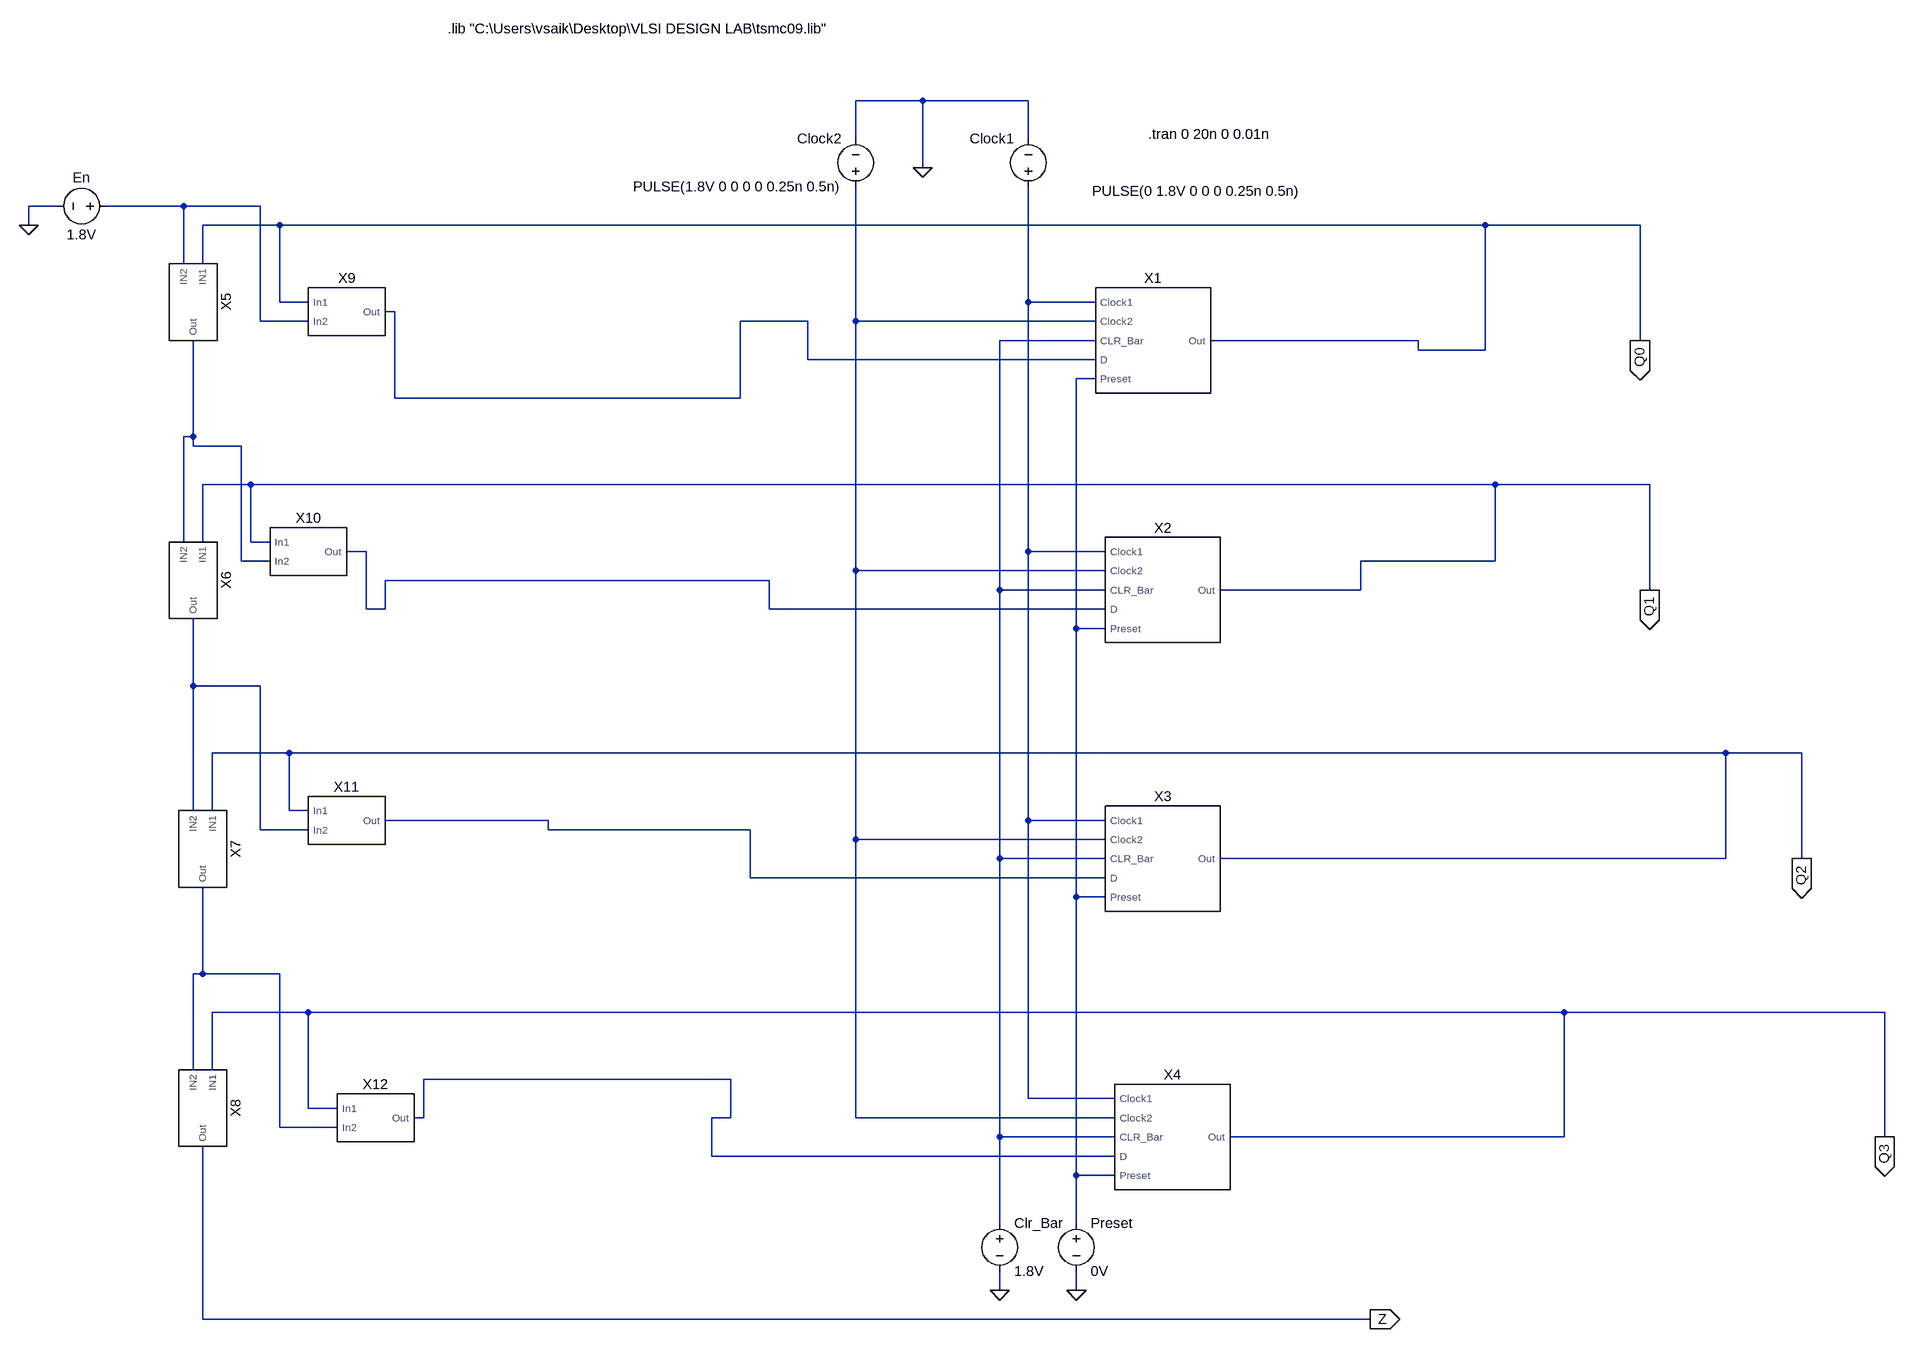
[diagram p0: schematic Counter1_P_Clr2_finally_final.asc]
Counter1_P_Clr2_finally_final.asc, the LTspice schematic file:
Version 4
SHEET 1 3432 2288
WIRE 912 160 800 160
WIRE 1088 160 912 160
WIRE 800 224 800 160
WIRE 1088 224 1088 160
WIRE 912 272 912 160
WIRE -560 336 -608 336
WIRE -320 336 -480 336
WIRE -192 336 -320 336
WIRE -608 368 -608 336
WIRE -160 368 -288 368
WIRE 2128 368 -160 368
WIRE 2464 368 2128 368
WIRE -320 432 -320 336
WIRE -288 432 -288 368
WIRE -160 496 -160 368
WIRE -112 496 -160 496
WIRE 1088 496 1088 304
WIRE 1200 496 1088 496
WIRE 32 512 16 512
WIRE -192 528 -192 336
WIRE -112 528 -192 528
WIRE 720 528 608 528
WIRE 800 528 800 304
WIRE 1200 528 800 528
WIRE 1200 560 1040 560
WIRE 1888 560 1392 560
WIRE 2464 560 2464 368
WIRE 1888 576 1888 560
WIRE 2128 576 2128 368
WIRE 2128 576 1888 576
WIRE 720 592 720 528
WIRE 1200 592 720 592
WIRE 1200 624 1168 624
WIRE 32 656 32 512
WIRE 608 656 608 528
WIRE 608 656 32 656
WIRE -304 720 -304 560
WIRE -304 720 -320 720
WIRE -304 736 -304 720
WIRE -224 736 -304 736
WIRE -208 800 -288 800
WIRE 2144 800 -208 800
WIRE 2480 800 2144 800
WIRE -320 896 -320 720
WIRE -288 896 -288 800
WIRE -208 896 -208 800
WIRE -176 896 -208 896
WIRE -16 912 -48 912
WIRE 1088 912 1088 496
WIRE 1216 912 1088 912
WIRE -224 928 -224 736
WIRE -176 928 -224 928
WIRE 2144 928 2144 800
WIRE 2144 928 1792 928
WIRE 800 944 800 528
WIRE 1216 944 800 944
WIRE 656 960 16 960
WIRE 1040 976 1040 560
WIRE 1216 976 1040 976
WIRE 1792 976 1792 928
WIRE 1792 976 1408 976
WIRE 2480 976 2480 800
WIRE -16 1008 -16 912
WIRE 16 1008 16 960
WIRE 16 1008 -16 1008
WIRE 656 1008 656 960
WIRE 1216 1008 656 1008
WIRE 1168 1040 1168 624
WIRE 1216 1040 1168 1040
WIRE -304 1136 -304 1024
WIRE -192 1136 -304 1136
WIRE -144 1248 -272 1248
WIRE 2720 1248 -144 1248
WIRE 2992 1248 2720 1248
WIRE -304 1344 -304 1136
WIRE -272 1344 -272 1248
WIRE -144 1344 -144 1248
WIRE -112 1344 -144 1344
WIRE 288 1360 16 1360
WIRE 1088 1360 1088 912
WIRE 1216 1360 1088 1360
WIRE -192 1376 -192 1136
WIRE -112 1376 -192 1376
WIRE 288 1376 288 1360
WIRE 624 1376 288 1376
WIRE 800 1392 800 944
WIRE 1216 1392 800 1392
WIRE 1040 1424 1040 976
WIRE 1216 1424 1040 1424
WIRE 2720 1424 2720 1248
WIRE 2720 1424 1408 1424
WIRE 2992 1424 2992 1248
WIRE 624 1456 624 1376
WIRE 1216 1456 624 1456
WIRE 1168 1488 1168 1040
WIRE 1216 1488 1168 1488
WIRE -288 1616 -288 1472
WIRE -288 1616 -304 1616
WIRE -160 1616 -288 1616
WIRE -112 1680 -272 1680
WIRE 2336 1680 -112 1680
WIRE 3360 1680 2336 1680
WIRE -304 1776 -304 1616
WIRE -272 1776 -272 1680
WIRE 592 1792 80 1792
WIRE 1088 1824 1088 1360
WIRE 1232 1824 1088 1824
WIRE -112 1840 -112 1680
WIRE -64 1840 -112 1840
WIRE 80 1856 80 1792
WIRE 80 1856 64 1856
WIRE 592 1856 592 1792
WIRE 592 1856 560 1856
WIRE 800 1856 800 1392
WIRE 1232 1856 800 1856
WIRE -160 1872 -160 1616
WIRE -64 1872 -160 1872
WIRE 1040 1888 1040 1424
WIRE 1232 1888 1040 1888
WIRE 2336 1888 2336 1680
WIRE 2336 1888 1424 1888
WIRE 3360 1888 3360 1680
WIRE 560 1920 560 1856
WIRE 1232 1920 560 1920
WIRE 1168 1952 1168 1488
WIRE 1232 1952 1168 1952
WIRE 1040 2032 1040 1888
WIRE 1168 2032 1168 1952
WIRE 1040 2144 1040 2112
WIRE 1168 2144 1168 2112
WIRE -288 2192 -288 1904
WIRE 1808 2192 -288 2192
FLAG -608 368 0
FLAG 1040 2144 0
FLAG 1168 2144 0
FLAG 912 272 0
FLAG 1808 2192 Z
IOPIN 1808 2192 Out
FLAG 2464 560 Q0
IOPIN 2464 560 Out
FLAG 2480 976 Q1
IOPIN 2480 976 Out
FLAG 2992 1424 Q2
IOPIN 2992 1424 Out
FLAG 3360 1888 Q3
IOPIN 3360 1888 Out
SYMBOL D_Flip_Flop_880_440_buffer_Pr_Clr 1296 560 R0
SYMATTR InstName X1
SYMBOL D_Flip_Flop_880_440_buffer_Pr_Clr 1312 976 R0
SYMATTR InstName X2
SYMBOL D_Flip_Flop_880_440_buffer_Pr_Clr 1312 1424 R0
SYMATTR InstName X3
SYMBOL D_Flip_Flop_880_440_buffer_Pr_Clr 1328 1888 R0
SYMATTR InstName X4
SYMBOL AND_model1 -304 496 R90
SYMATTR InstName X5
SYMBOL AND_model1 -304 960 R90
SYMATTR InstName X6
SYMBOL AND_model1 -288 1408 R90
SYMATTR InstName X7
SYMBOL AND_model1 -288 1840 R90
SYMATTR InstName X8
SYMBOL XOR_model1 -48 512 R0
SYMATTR InstName X9
SYMBOL XOR_model1 0 1856 R0
SYMATTR InstName X12
SYMBOL voltage -464 336 R90
WINDOW 0 -32 56 VBottom 2
WINDOW 3 32 56 VTop 2
WINDOW 123 0 0 Left 0
WINDOW 39 0 0 Left 0
SYMATTR InstName En
SYMATTR Value 1.8V
SYMBOL voltage 1088 320 R180
WINDOW 0 24 96 Left 2
WINDOW 3 -453 9 Left 2
WINDOW 123 0 0 Left 0
WINDOW 39 0 0 Left 0
SYMATTR InstName Clock1
SYMATTR Value PULSE(0 1.8V 0 0 0 0.25n 0.5n)
SYMBOL voltage 800 320 R180
WINDOW 0 24 96 Left 2
WINDOW 3 24 16 Left 2
WINDOW 123 0 0 Left 0
WINDOW 39 0 0 Left 0
SYMATTR InstName Clock2
SYMATTR Value PULSE(1.8V 0 0 0 0 0.25n 0.5n)
SYMBOL voltage 1168 2016 R0
WINDOW 123 0 0 Left 0
WINDOW 39 0 0 Left 0
SYMATTR InstName Preset
SYMATTR Value 0V
SYMBOL voltage 1040 2016 R0
WINDOW 123 0 0 Left 0
WINDOW 39 0 0 Left 0
SYMATTR InstName Clr_Bar
SYMATTR Value 1.8V
SYMBOL XOR_model1 -112 912 R0
SYMATTR InstName X10
SYMBOL XOR_model1 -48 1360 R0
SYMATTR InstName X11
TEXT 120 40 Left 2 !.lib "C:\\Users\\vsaik\\Desktop\\VLSI DESIGN LAB\\tsmc09.lib"
TEXT 1288 216 Left 2 !.tran 0 20n 0 0.01n

The netlist it stands for:
* Counter1_P_Clr2_finally_final.asc
XX1 N002 N004 N005 N003 N006 Q0 DFF0  ; pins Clock1 Clock2 CLR_Bar D Preset Out
XX2 N002 N004 N005 N008 N006 Q1 DFF0  ; pins Clock1 Clock2 CLR_Bar D Preset Out
XX3 N002 N004 N005 N010 N006 Q2 DFF0  ; pins Clock1 Clock2 CLR_Bar D Preset Out
XX4 N002 N004 N005 N012 N006 Q3 DFF0  ; pins Clock1 Clock2 CLR_Bar D Preset Out
XX5 Q0 N001 N007 AND0  ; pins IN1 IN2 Out
XX6 Q1 N007 N009 AND0  ; pins IN1 IN2 Out
XX7 Q2 N009 N011 AND0  ; pins IN1 IN2 Out
XX8 Q3 N011 Z AND0  ; pins IN1 IN2 Out
XX9 Q0 N001 N003 XOR0  ; pins In1 In2 Out
XX12 Q3 N011 N012 XOR0  ; pins In1 In2 Out
V§En N001 0 1.8V
V§Clock1 N002 0 PULSE(0 1.8V 0 0 0 0.25n 0.5n)
V§Clock2 N004 0 PULSE(1.8V 0 0 0 0 0.25n 0.5n)
V§Preset N006 0 0V
V§Clr_Bar N005 0 1.8V
XX10 Q1 N007 N008 XOR0  ; pins In1 In2 Out
XX11 Q2 N009 N010 XOR0  ; pins In1 In2 Out
.lib "C:\Users\vsaik\Desktop\VLSI DESIGN LAB\tsmc09.lib"
.tran 0 20n 0 0.01n
.backanno
.end